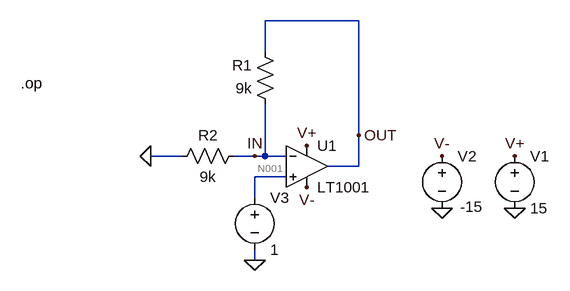
[diagram p0: schematic Non-inverting amplifier.asc]
Non-inverting amplifier.asc, the LTspice schematic file:
Version 4
SHEET 1 880 680
WIRE 288 -80 144 -80
WIRE 144 -32 144 -80
WIRE 288 96 288 -80
WIRE 16 128 -32 128
WIRE 128 128 96 128
WIRE 144 128 144 48
WIRE 144 128 128 128
WIRE 176 128 144 128
WIRE 288 144 288 96
WIRE 288 144 240 144
WIRE 176 160 128 160
WIRE 128 192 128 160
WIRE 128 288 128 272
FLAG 128 288 0
FLAG -32 128 0
FLAG 128 128 IN
FLAG 288 96 OUT
FLAG 416 208 0
FLAG 528 208 0
FLAG 528 128 V+
FLAG 208 112 V+
FLAG 416 128 V-
FLAG 208 176 V-
SYMBOL Opamps\\LT1001 208 80 R0
SYMATTR InstName U1
SYMBOL res 160 64 R180
WINDOW 0 36 76 Left 2
WINDOW 3 36 40 Left 2
SYMATTR InstName R1
SYMATTR Value 9k
SYMBOL res 0 144 R270
WINDOW 0 32 56 VTop 2
WINDOW 3 0 56 VBottom 2
SYMATTR InstName R2
SYMATTR Value 9k
SYMBOL voltage 528 112 R0
WINDOW 123 24 124 Left 2
WINDOW 39 0 0 Left 0
SYMATTR InstName V1
SYMATTR Value 15
SYMBOL voltage 416 112 R0
WINDOW 3 28 94 Left 2
WINDOW 123 0 0 Left 0
WINDOW 39 0 0 Left 0
SYMATTR InstName V2
SYMATTR Value -15
SYMBOL voltage 128 176 R0
WINDOW 123 0 0 Left 0
WINDOW 39 0 0 Left 0
SYMATTR InstName V3
SYMATTR Value 1
TEXT -232 16 Left 2 !.op

The netlist it stands for:
* Non-inverting amplifier.asc
XU1 N001 IN V+ V- OUT LT1001  ; pins In+ In- V+ V- OUT
R1 IN OUT 9k
R2 0 IN 9k
V1 V+ 0 15
V2 V- 0 -15
V3 N001 0 1
.op
.lib LTC.lib
.backanno
.end

* Results of the author's LTspice run, read from the files saved beside the schematic
* Operating Point:
*   V(in) = 1 V
*   V(n001) = 1 V
*   V(v+) = 15 V
*   V(v-) = -15 V
*   V(out) = 2 V
*   I(R2) = -111.1 µA
*   I(R1) = -111.1 µA
*   I(V3) = -1.822 pA
*   I(V2) = 2.195 mA
*   I(V1) = -2.306 mA
*   Ix(u1:1) = 1.822 pA
*   Ix(u1:2) = 1.749 pA
*   Ix(u1:3) = 2.306 mA
*   Ix(u1:4) = -2.195 mA
*   Ix(u1:5) = -111.1 µA
* From the log:
*   Semiconductor Device Operating Points:
*                           --- Diodes ---
*   Name:    d:u1:4      d:u1:1
*   Model:    u1:di       u1:x
*   Id:     -2.68e-15   -3.71e-15
*   Vd:     -2.68e-06   -3.70e-03
*   Req:     1.00e-09    1.00e-12
*   CAP:     0.00e+00    0.00e+00
*                           --- VDMOSFET Transistors ---
*   Name:        m:u1:2      m:u1:1
*   Model:        u1:p        u1:n
*   Id:         -2.19e-03    2.31e-03
*   Vgs:         3.70e-03    3.70e-03
*   Vds:        -1.70e+01    1.30e+01
*   Vth:         3.00e-01   -3.00e-01
*   Gm:          1.48e-02    1.52e-02
*   Gds:         0.00e+00    0.00e+00
*   Cgs:         0.00e+00    0.00e+00
*   Cgd:         0.00e+00    0.00e+00
*   Cbody:       0.00e+00    0.00e+00